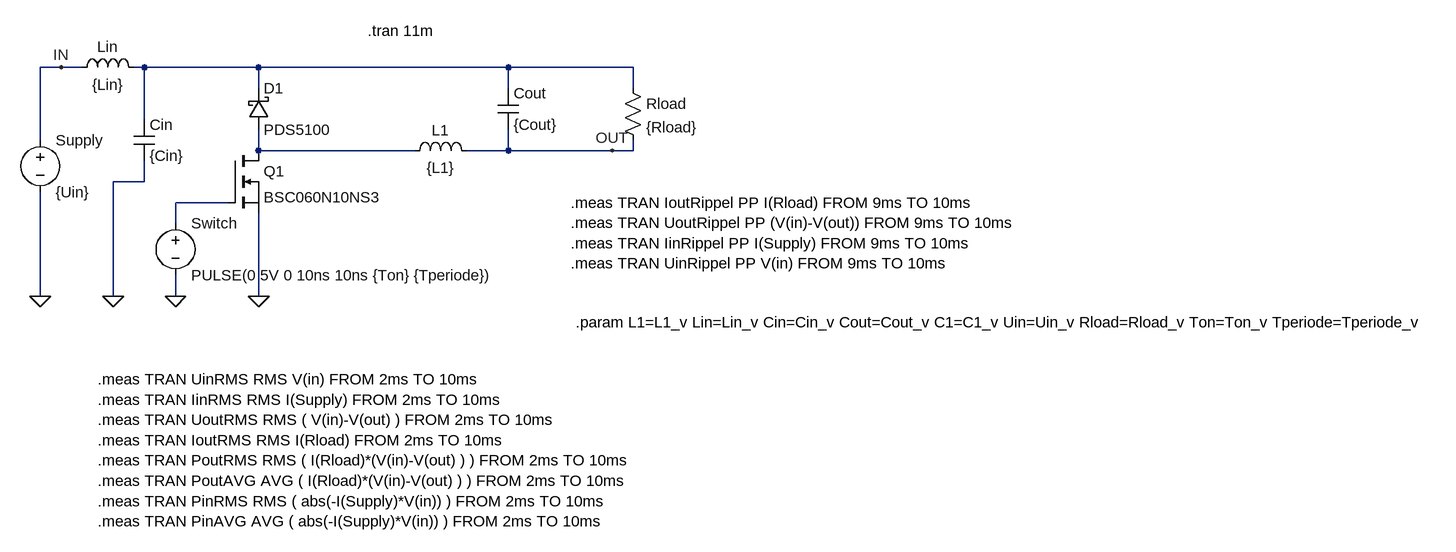
[diagram p0: schematic BuckInFilterVariable.asc]
BuckInFilterVariable.asc, the LTspice schematic file:
Version 4
SHEET 1 3080 1464
WIRE 912 352 880 352
WIRE 944 352 912 352
WIRE 1040 352 1024 352
WIRE 1216 352 1040 352
WIRE 1600 352 1216 352
WIRE 1792 352 1600 352
WIRE 1216 384 1216 352
WIRE 1600 384 1600 352
WIRE 1792 384 1792 352
WIRE 1040 432 1040 352
WIRE 880 464 880 352
WIRE 1216 480 1216 448
WIRE 1456 480 1216 480
WIRE 1600 480 1600 448
WIRE 1600 480 1536 480
WIRE 1760 480 1600 480
WIRE 1792 480 1792 464
WIRE 1792 480 1760 480
WIRE 1040 528 1040 496
WIRE 1040 528 992 528
WIRE 1168 560 1088 560
WIRE 1088 592 1088 560
WIRE 880 704 880 544
WIRE 992 704 992 528
WIRE 1088 704 1088 672
WIRE 1216 704 1216 576
FLAG 1760 480 OUT
FLAG 912 352 IN
FLAG 1216 704 0
FLAG 880 704 0
FLAG 1088 704 0
FLAG 992 704 0
SYMBOL nmos 1168 480 R0
SYMATTR InstName Q1
SYMATTR Value BSC060N10NS3
SYMBOL ind 1440 496 R270
WINDOW 0 32 56 VTop 2
WINDOW 3 5 56 VBottom 2
SYMATTR InstName L1
SYMATTR Value {L1}
SYMATTR SpiceLine Ipk=16.7 Rser=0.0187 Rpar=3108.6 Cpar=0
SYMBOL schottky 1200 448 M180
WINDOW 0 24 64 Left 2
WINDOW 3 24 0 Left 2
SYMATTR InstName D1
SYMATTR Value PDS5100
SYMATTR Description Diode
SYMATTR Type diode
SYMBOL cap 1584 384 R0
SYMATTR SpiceLine Rser=0.004
SYMATTR Value {Cout}
SYMATTR InstName Cout
SYMBOL res 1776 368 R0
SYMATTR InstName Rload
SYMATTR Value {Rload}
SYMBOL voltage 880 448 R0
WINDOW 123 0 0 Left 2
WINDOW 39 0 0 Left 2
SYMATTR InstName Supply
SYMATTR Value {Uin}
SYMBOL voltage 1088 576 R0
WINDOW 123 0 0 Left 2
WINDOW 39 0 0 Left 2
SYMATTR InstName Switch
SYMATTR Value PULSE(0 5V 0 10ns 10ns {Ton} {Tperiode})
SYMBOL ind 928 368 R270
WINDOW 0 32 56 VTop 2
WINDOW 3 5 56 VBottom 2
SYMATTR InstName Lin
SYMATTR Value {Lin}
SYMATTR SpiceLine Ipk=16.7 Rser=0.0187 Rpar=3108.6 Cpar=0
SYMBOL cap 1024 432 R0
SYMATTR SpiceLine Rser=0.004
SYMATTR Value {Cin}
SYMATTR InstName Cin
TEXT 1384 296 Left 2 !.tran 11m
TEXT 968 832 Left 2 !.meas TRAN UinRMS RMS V(in) FROM 2ms TO 10ms\n.meas TRAN IinRMS RMS I(Supply) FROM 2ms TO 10ms\n.meas TRAN UoutRMS RMS ( V(in)-V(out) ) FROM 2ms TO 10ms\n.meas TRAN IoutRMS RMS I(Rload) FROM 2ms TO 10ms\n.meas TRAN PoutRMS RMS ( I(Rload)*(V(in)-V(out) ) ) FROM 2ms TO 10ms\n.meas TRAN PoutAVG AVG ( I(Rload)*(V(in)-V(out) ) ) FROM 2ms TO 10ms\n.meas TRAN PinRMS RMS ( abs(-I(Supply)*V(in)) ) FROM 2ms TO 10ms\n.meas TRAN PinAVG AVG ( abs(-I(Supply)*V(in)) ) FROM 2ms TO 10ms
TEXT 1696 560 Left 2 !.meas TRAN IoutRippel PP I(Rload) FROM 9ms TO 10ms\n.meas TRAN UoutRippel PP (V(in)-V(out)) FROM 9ms TO 10ms\n.meas TRAN IinRippel PP I(Supply) FROM 9ms TO 10ms\n.meas TRAN UinRippel PP V(in) FROM 9ms TO 10ms
TEXT 1704 744 Left 2 !.param L1=L1_v Lin=Lin_v Cin=Cin_v Cout=Cout_v C1=C1_v Uin=Uin_v Rload=Rload_v Ton=Ton_v Tperiode=Tperiode_v

The netlist it stands for:
* BuckInFilterVariable.asc
M§Q1 N002 N003 0 0 BSC060N10NS3
L1 N002 OUT {L1} Ipk=16.7 Rser=0.0187 Rpar=3108.6 Cpar=0
D1 N002 N001 PDS5100
Cout N001 OUT {Cout} Rser=0.004
Rload N001 OUT {Rload}
V§Supply IN 0 {Uin}
V§Switch N003 0 PULSE(0 5V 0 10ns 10ns {Ton} {Tperiode})
Lin IN N001 {Lin} Ipk=16.7 Rser=0.0187 Rpar=3108.6 Cpar=0
Cin N001 0 {Cin} Rser=0.004
.model D D
.lib standard.dio
.model NMOS NMOS
.model PMOS PMOS
.lib standard.mos
.tran 11m
.meas TRAN UinRMS RMS V(in) FROM 2ms TO 10ms
.meas TRAN IinRMS RMS I(Supply) FROM 2ms TO 10ms
.meas TRAN UoutRMS RMS ( V(in)-V(out) ) FROM 2ms TO 10ms
.meas TRAN IoutRMS RMS I(Rload) FROM 2ms TO 10ms
.meas TRAN PoutRMS RMS ( I(Rload)*(V(in)-V(out) ) ) FROM 2ms TO 10ms
.meas TRAN PoutAVG AVG ( I(Rload)*(V(in)-V(out) ) ) FROM 2ms TO 10ms
.meas TRAN PinRMS RMS ( abs(-I(Supply)*V(in)) ) FROM 2ms TO 10ms
.meas TRAN PinAVG AVG ( abs(-I(Supply)*V(in)) ) FROM 2ms TO 10ms
.meas TRAN IoutRippel PP I(Rload) FROM 9ms TO 10ms
.meas TRAN UoutRippel PP (V(in)-V(out)) FROM 9ms TO 10ms
.meas TRAN IinRippel PP I(Supply) FROM 9ms TO 10ms
.meas TRAN UinRippel PP V(in) FROM 9ms TO 10ms
.param L1=L1_v Lin=Lin_v Cin=Cin_v Cout=Cout_v C1=C1_v Uin=Uin_v Rload=Rload_v Ton=Ton_v Tperiode=Tperiode_v
.backanno
.end